# Altium project Thingy91_Nowi_Plugin.PrjPcb
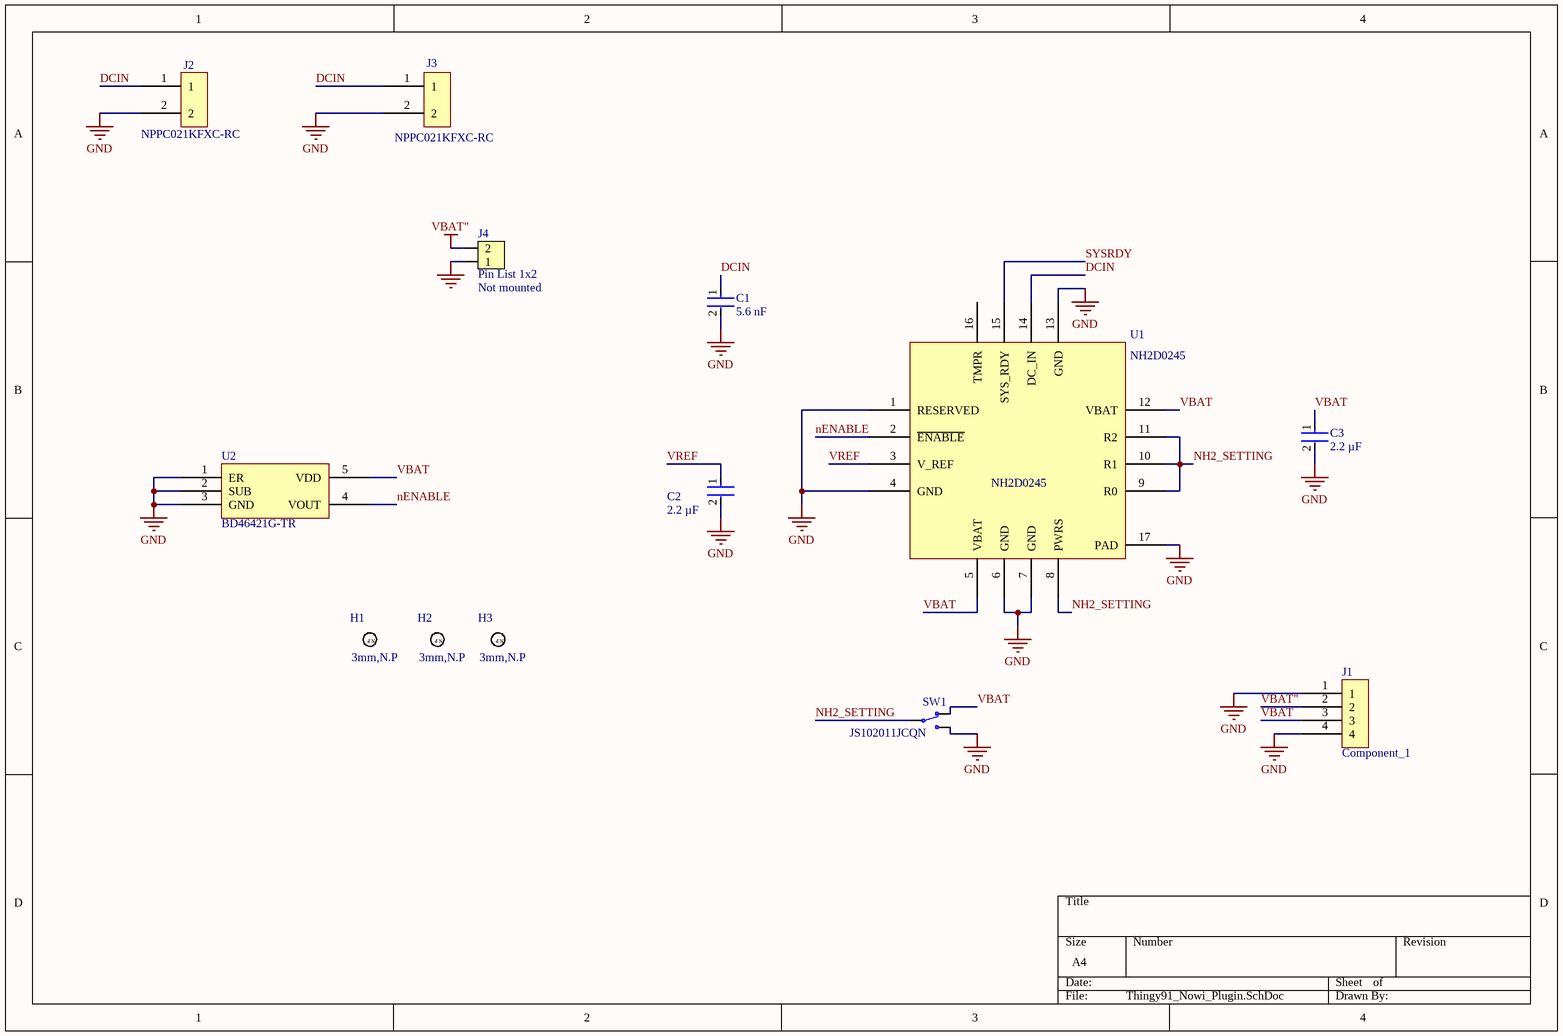
[diagram p0: Thingy91_Nowi_Plugin.SchDoc]
2 sheets, 16 parts. Net scope: global (net labels, ports and power ports of the same name join across sheets).
Board files: Thingy91_Nowi_Plugin.PcbDoc, Thingy91_PV_Board.PcbDoc
Sheets:
  Thingy91_Nowi_Plugin.SchDoc
  Thingy91_PV_Board.SchDoc

## Sheet Thingy91_Nowi_Plugin.SchDoc
size A4; SheetNumber: 1; SheetTotal: 2

### Parts
(Parts that share a designator on the sheet are numbered #1, #2 ... from top to bottom, then left to right.)
C1  5.6 nF  [FP-CL842-IPC_C]
C2  2.2 µF  [FP-CL127-IPC_C]
C3  2.2 µF  [FP-CL127-IPC_C]
H1  3mm,N.P  [HOLE_NP_3MM]  (no BOM)
H2  3mm,N.P  [HOLE_NP_3MM]  (no BOM)
H3  3mm,N.P  [HOLE_NP_3MM]  (no BOM)
J1#1  Component_1  [M208900405]
J2#1  NPPC021KFXC-RC  [PCBComponent_1]
J3  NPPC021KFXC-RC  [PCBComponent_1]
J4  Pin List 1x2  Assembly: Not mounted  [LIST_1x2-NC]
SW1  JS102011JCQN  [JS102011JCQN]
U1#1  NH2D0245  [PCBComponent_1]
U2  BD46421G-TR  [SOT95P280X110-5N]

### Nets
GND: C1.2 C2.2 C3.2 J1#1.1 J1#1.4 J2#1.2 J3.2 J4.1 SW1.3(N.O) U1#1.1(RESERVED) U1#1.4(GND) U1#1.6(GND) U1#1.7(GND) U1#1.13(GND) U1#1.17(PAD) U2.1(ER) U2.2(SUB) U2.3(GND)
VBAT": J1#1.2 J4.2
DCIN: C1.1 J2#1.1 J3.1 U1#1.14(DC_IN)
nENABLE: U1#1.2(~{ENABLE}) U2.4(VOUT)
NH2_SETTING: SW1.2(COM) U1#1.8(PWRS) U1#1.9(R0) U1#1.10(R1) U1#1.11(R2)
SYSRDY: U1#1.15(SYS_RDY)
VBAT: C3.1 J1#1.3 SW1.1(N.C) U1#1.5(VBAT) U1#1.12(VBAT) U2.5(VDD)
VREF: C2.1 U1#1.3(V_REF)

Not connected (* = marked no-connect by the designer): H1 1; H2 1; H3 1; U1#1 16(TMPR)

### Notes on the sheet
- (in symbol Hole_3MM_NP) N.P

### Library data of the parts
C1 = CMP-13271-000455-1: 5.6nF ±10% 25V Ceramic Capacitor X7R 0402 (1005 Metric); Manufacturer: Samsung Electro-Mechanics; Manufacturer Part Number: CL05B562KA5NNNC; Radiation Hardening: No; Thickness: 0.022inch; Voltage Rating (DC): 25V; Mount: Surface Mount; Case/Package: 0402; Package Quantity: 1; Voltage Rating: 25V; Width: 0.02inch; Length: 1mm; Capacitance: 5.6nF; Min Operating Temperature: -55°C; Voltage: 25V; Dielectric: X7R; Tolerance: 10%; Max Operating Temperature: 125°C; Height: 0.5mm; Case Code (Metric): 1005; Packaging: Tape and Reel; Case Code (Imperial): 0402; Depth: 0.5mm; Value: 5.6nF; Digi-Key Part Number: 1276-1578-1-ND
C2 C3 = CMP-13271-002909-1: 2.2µF ±20% 16V Ceramic Capacitor X5R 0402 (1005 Metric); Manufacturer: Taiyo Yuden; Manufacturer Part Number: EMK105ABJ225MV-F; Capacitance: 2.2uF; Case Code (Imperial): 0402; Case/Package: 0402; Mount: Surface Mount; Thickness: 0.022inch; Tolerance: 20%; Radiation Hardening: No; Min Operating Temperature: -55°C; Dielectric: X5R; Depth: 0.5mm; Voltage Rating: 16V; Width: 0.02inch; Max Operating Temperature: 85°C; Package Quantity: 1; Height: 0.5mm; Contact Plating: Tin; Length: 1mm; Case Code (Metric): 1005; Packaging: Tape and Reel; Digi-Key Part Number: 587-3302-1-ND
  C2: Value: 2.2µF
  C3: Value: 2.2 µF
H1-H3 = Hole_3MM_NP: Regular Non-Plated, 3mm hole; Manufacturer: Nordic Semiconductor; Manufacturer Part Number: N.A.; Pad Count: 1; Part Number: Hole_3MM_NP; Footprint Doc: Hole_3MM_NP; LatestRevisionDate: 2009-12-12; Published: 2009-12-12; Value: 3mm,N.P; Note: Regular Non-Plated, 3mm hole; Artikkelnr Noca: N.A.; Part number IPS: N.A.; ComponentLink1URL: N.A.; ComponentLink1Description: Datasheet; ComponentLink2URL: N.A.; ComponentLink2Description: Supplier link; HelpURL: N.A.; Supplier 1: N.A.; Supplier Part Number 1: N.A.; Supplier 2: N.A.; Supplier Part Number 2: N.A.; Component Class: Connectors; PartId: 100500145
J2#1 J3 = Component_1: 2 Position Header, Top or Bottom Entry Connector 0.100" (2.54mm) Surface Mount Gold; Manufacturer: Sullins Connector Solutions; Manufacturer Part Number: NPPC021KFXC-RC; Digi-Key Part Number: S5633-ND; Value: NPPC021KFXC-RC
J4 = Pin List 1x2, N.C.: Pin List 1x2, 2.54mm (100mil); Manufacturer: N.A.; Pad Count: 2; Part Number: Pin List 1x2, N.C.; Manufacturer Part Number: N.A.; Footprint Doc: LIST_1x2; LatestRevisionDate: 2017-02-02; Published: 2017-01-30; Value: Pin List 1x2; Note: N.A.; Artikkelnr Noca: N.A.; Part number IPS: N.A.; ComponentLink1URL: N.A.; ComponentLink1Description: Datasheet; ComponentLink2URL: N.A.; ComponentLink2Description: Supplier link; HelpURL: N.A.; Supplier 1: N.A.; Supplier Part Number 1: N.A.; Supplier 2: N.A.; Supplier Part Number 2: N.A.; Component Class: Connectors; PartId: 100500298
SW1 = JS102011JCQN: SWITCH SLIDE SPDT 300MA 6V; Manufacturer: C&K Components; Part number IPS: 00000009980; Artikkelnr Noca: N.A.; Part Number: JS102011JCQN; Manufacturer Part Number: JS102011JCQN; LatestRevisionDate: 2017-02-15; Pin Count: 3; Publisher: Nordic Semiconductor; Published: 2017-02-15; Value: JS102011JCQN; Note: *; ComponentLink1URL: *; ComponentLink1Description: Datasheet; ComponentLink2URL: *; ComponentLink2Description: Supplier link; HelpURL: http://www.ckswitches.com/media/1422/js.pdf; Footprint Doc: *; Supplier 1: Digi-Key; Supplier Part Number 1: CKN10721CT-ND; Supplier 2: Mouser; Supplier Part Number 2: 611-JS102011JCQN
U1#1 = Component_1: NH2D0245 Energy Harvesting PMIC; Manufacturer: Nowi; Value: NH2D0245; Manufacturer Part Number: NH2D0245; Digi-Key Part Number: 3344-NH2D0245TR-ND
U2 = Component_1

## Sheet Thingy91_PV_Board.SchDoc
size A4; SheetNumber: 2; SheetTotal: 2
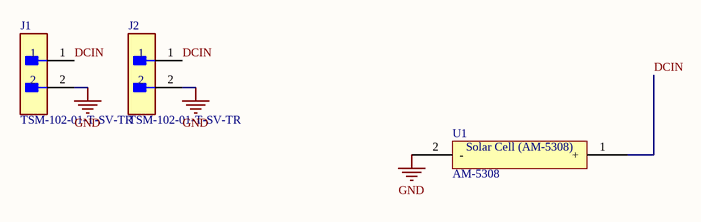
[diagram p1: Thingy91_PV_Board.SchDoc]

### Parts
(Parts that share a designator on the sheet are numbered #1, #2 ... from top to bottom, then left to right.)
J1#2  TSM-102-01-T-SV-TR  [FP-TSM-102-01-T-SV-TR-MFG]
J2#2  TSM-102-01-T-SV-TR  [FP-TSM-102-01-T-SV-TR-MFG]
U1#2  AM-5308  [PCBComponent_1]

### Nets
GND: J1#2.2 J2#2.2 U1#2.2(-)
DCIN: J1#2.1 J2#2.1 U1#2.1(+)

### Notes on the sheet
- (in symbol AM-5308) Solar Cell (AM-5308)

### Library data of the parts
J1#2 J2#2 = CMP-02766-000113-1: CONN HEADER SMD 2POS 2.54MM; Gender: Male; Max Voltage Rating (AC): 475V; Number of Contacts: 2; Max Current Rating: 7A; Contact Material: Bronze; Min Operating Temperature: -55°C; REACH SVHC: No SVHC; Housing Material: Polymer; Lead Free: Lead Free; Orientation: Straight; Radiation Hardening: No; Number of Rows: 1; Length: 5.08mm; Housing Color: Black; Max Operating Temperature: 105°C; Contact Plating: Tin; Depth: 2.54mm; Packaging: Tape and Reel; Pitch: 2.54mm; Termination: Solder
U1#2 = AM-5308: AM-5308 Panasonic PV

## Nets that join several sheets
GND: Thingy91_Nowi_Plugin (18 pins), Thingy91_PV_Board (J1#2.2 J2#2.2 U1#2.2)
DCIN: Thingy91_Nowi_Plugin (C1.1 J2#1.1 J3.1 U1#1.14), Thingy91_PV_Board (J1#2.1 J2#2.1 U1#2.1)